# Altium schematic sheet 07 USB.SchDoc
size 420 x 297 mm
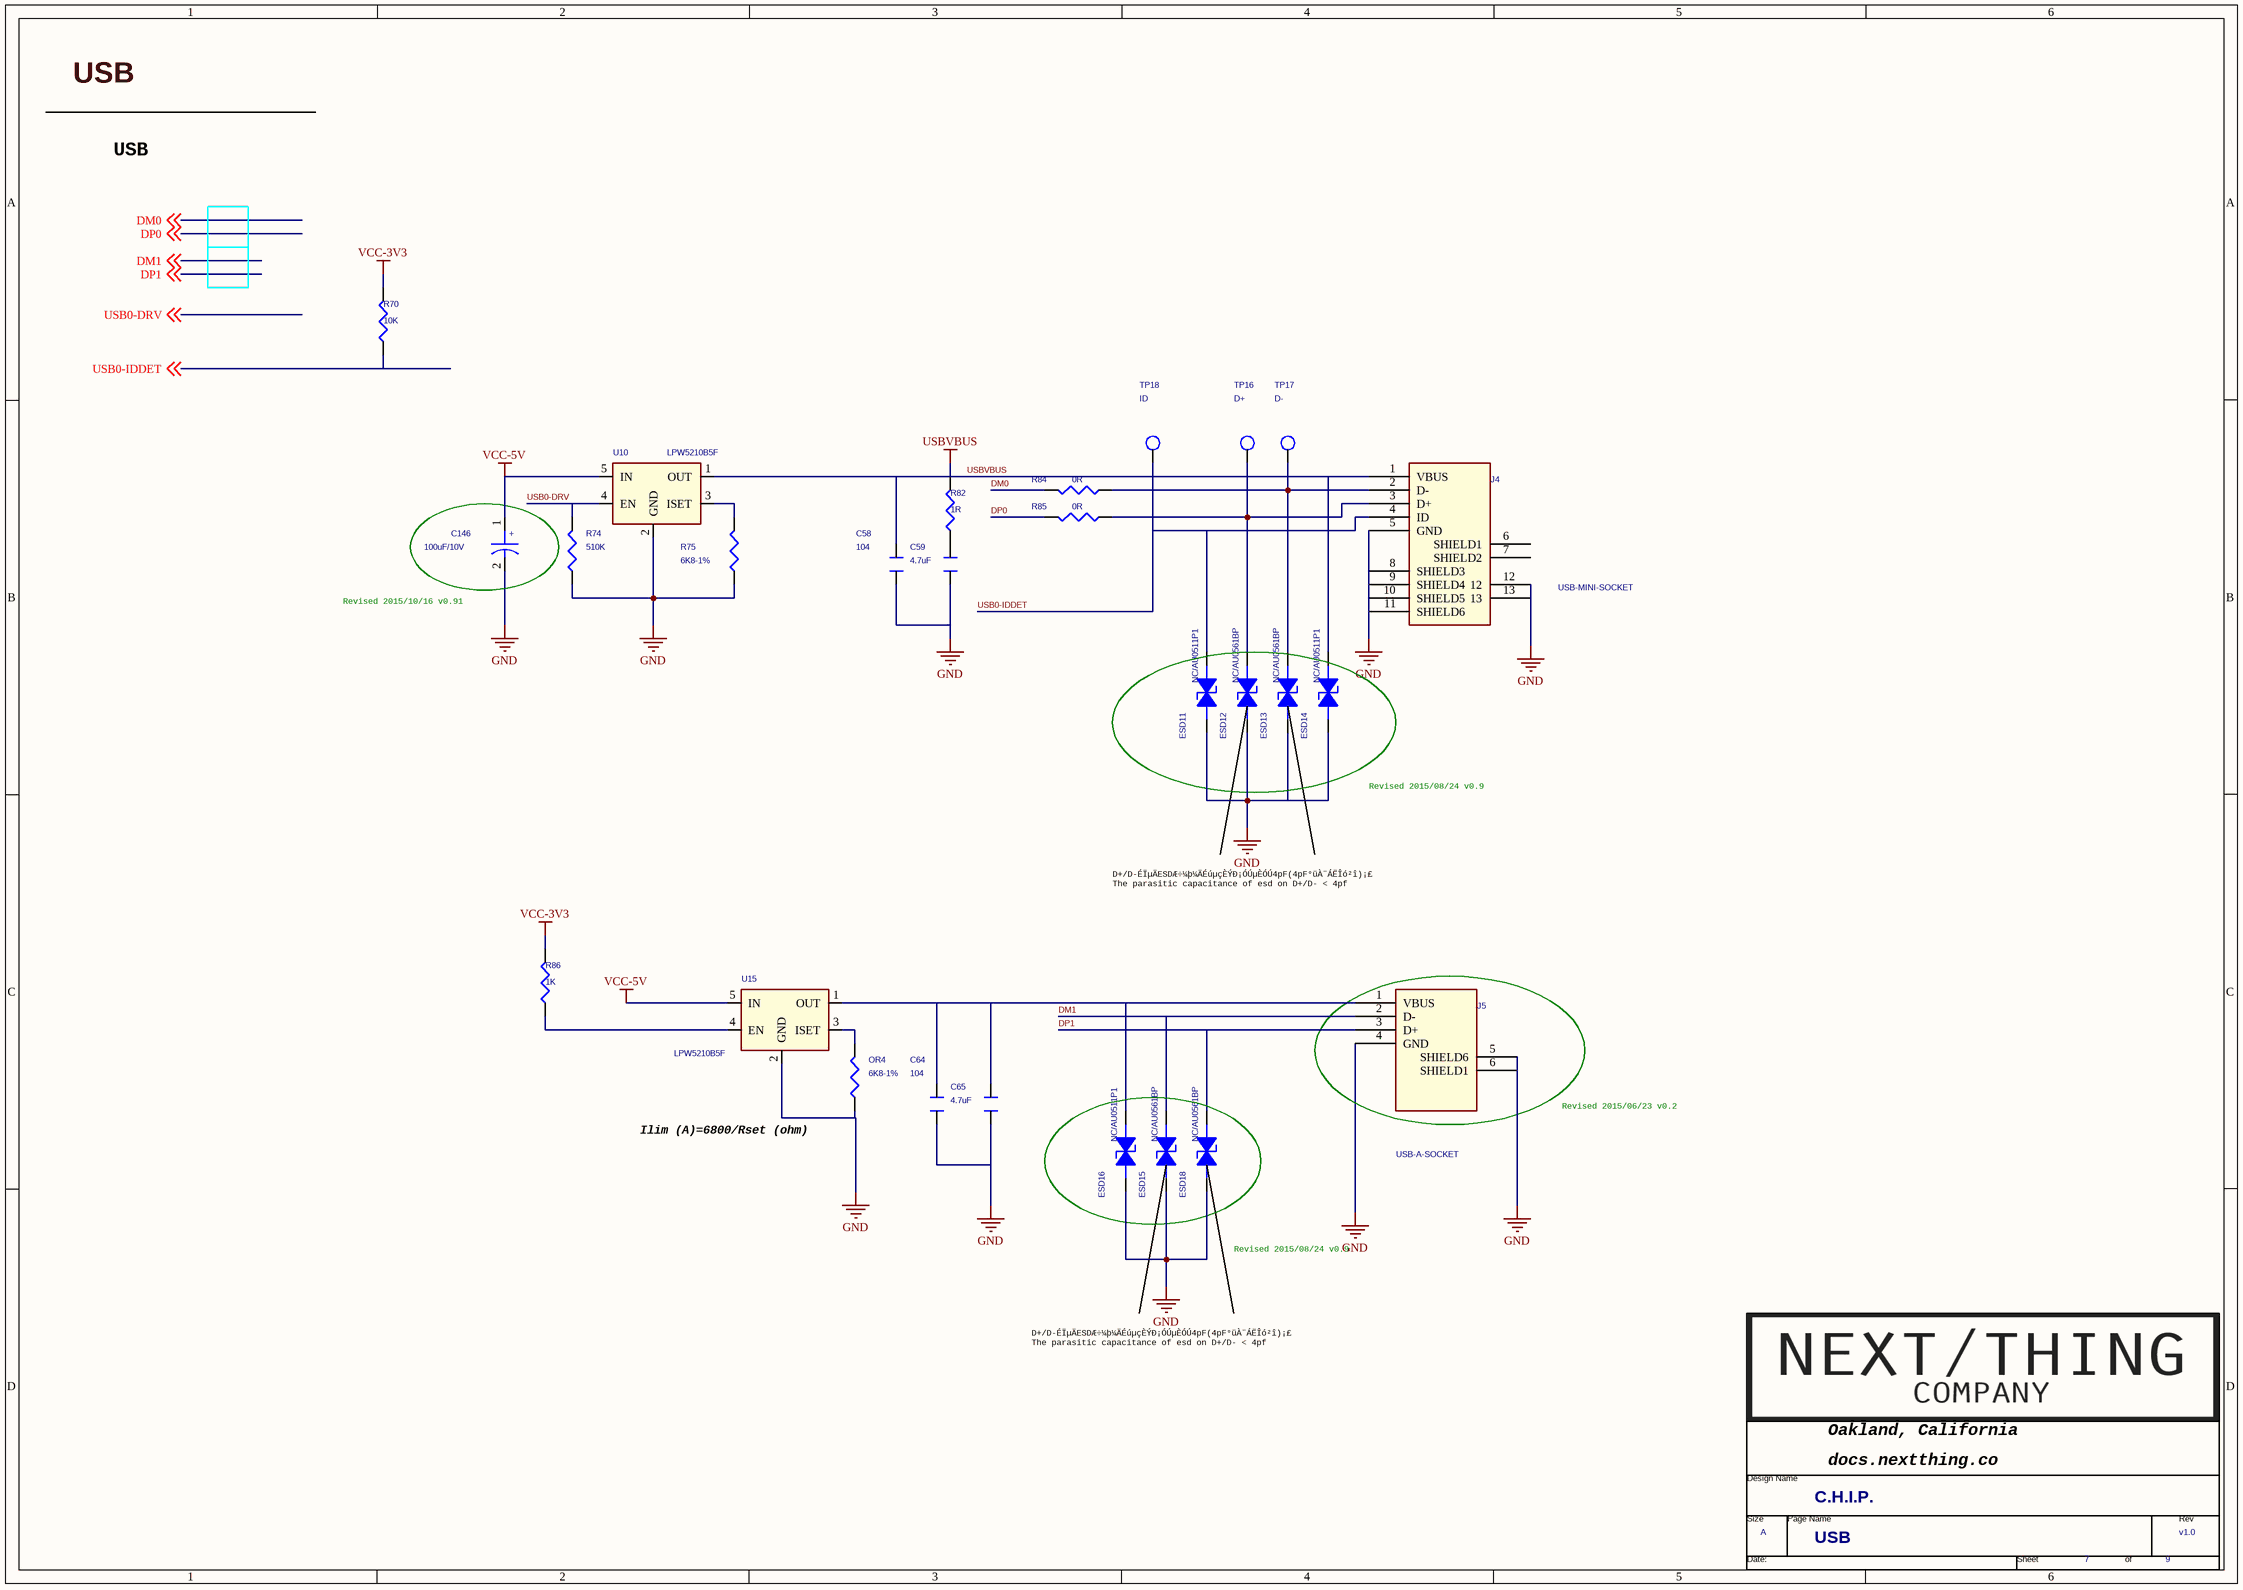
[diagram p0: 07 USB.SchDoc]

## Parts
*  Page Count: 9  Page Number: 7  Page Size: A  Title: C.H.I.P.  RevCode: v1.0  Doc: USB  (hidden comment: TitleBlock1-nextthing)  (graphical)
C58  104  [C0201]
C59  4.7uF  [CC0603]
C64  104  [C0201]
C65  4.7uF  [CC0603]
C146  100uF/10V  [CT1210]
ESD11  NC/AU0511P1  [R0402]
ESD12  NC/AU0561BP  [R0402]
ESD13  NC/AU0561BP  [R0402]
ESD14  NC/AU0511P1  [R0402]
ESD15  NC/AU0561BP  [R0402]
ESD16  NC/AU0511P1  [R0402]
ESD18  NC/AU0561BP  [R0402]
J4  USB-MINI-SOCKET  [USB_MINI_AB]
J5  USB-A-SOCKET  [USB_MINI_AB]
OR4  6K8-1%  [C0201]
R70  10K  [C0201]
R74  510K  [C0201]
R75  6K8-1%  [C0201]
R82  1R  [R0402]
R84  0R  [C0201]
R85  0R  [C0201]
R86  1K  [C0201]
TP16  D+  [tp40_smd]
TP17  D-  [tp40_smd]
TP18  ID  [tp40_smd]
U10  LPW5210B5F  [SOT23-6]
U15  LPW5210B5F  [SOT23-6]

## Nets
GND: C58.1 C59.1 C64.1 C65.1 C146.2 ESD11.2(CATHODE) ESD12.2(CATHODE) ESD13.2(CATHODE) ESD14.2(CATHODE) ESD15.2(CATHODE) ESD16.2(CATHODE) ESD18.2(CATHODE) J4.5(GND) J4.8(SHIELD3) J4.9(SHIELD4) J4.10(SHIELD5) J4.11(SHIELD6) J4.12 J4.13 J5.4(GND) J5.5(SHIELD6) J5.6(SHIELD1) OR4.1 R74.1 R75.1 U10.2(GND) U15.2(GND)
USBVBUS: C58.2 ESD14.1(ANODE) J4.1(VBUS) R82.2 U10.1(OUT)
VCC-3V3: R70.2 R86.2
VCC-5V: C146.1 U10.5(IN) U15.5(IN)
DM0: R84.2 ; off-sheet DM0
DM1: ESD15.1(ANODE) J5.2(D-) ; off-sheet DM1
DP0: R85.2 ; off-sheet DP0
DP1: ESD18.1(ANODE) J5.3(D+) ; off-sheet DP1
USB0-DRV: R74.2 U10.4(EN) ; off-sheet USB0-DRV
USB0-IDDET: ESD11.1(ANODE) J4.4(ID) R70.1 TP18.1(TP) ; off-sheet USB0-IDDET
NetC59_2: C59.2 R82.1
NetC64_2: C64.2 C65.2 ESD16.1(ANODE) J5.1(VBUS) U15.1(OUT)
NetESD12_1: ESD12.1(ANODE) J4.3(D+) R85.1 TP16.1(TP)
NetESD13_1: ESD13.1(ANODE) J4.2(D-) R84.1 TP17.1(TP)
NetOR4_2: OR4.2 U15.3(ISET)
NetR75_2: R75.2 U10.3(ISET)
NetR86_1: R86.1 U15.4(EN)

Not connected (* = marked no-connect by the designer): J4 6(SHIELD1) 7(SHIELD2)

## Notes on the sheet
- USB
- Revised 2015/10/16 v0.91
- Revised 2015/08/24 v0.9
- D+/D-ÉÏµÄESDÆ÷¼þ¼ÄÉúµçÈÝÐ¡ÓÚµÈÓÚ4pF(4pF°üÀ¨ÁËÎó²î)¡£
  The parasitic capacitance of esd on D+/D- < 4pf
- Ilim (A)=6800/Rset (ohm)
- Revised 2015/06/23 v0.2
- (in symbol CAPACITOR_POL) +
- (in symbol TitleBlock1-nextthing) Oakland, California; Design Name; docs.nextthing.co /; Size; Page Name; Rev; Date:; Sheet; of

## Library data of the parts
C58 C59 C64 C65 = CAPACITOR
C146 = CAPACITOR_POL: ROOM: MODEM
ESD11-ESD16 ESD18 = 1_1.5KE100A: 1ST PART DESCRIPTION: WILL ESD9B5V Bidirection ESD Protection
J4 = USB_MINI_SOCKET_2
J5 = USB_MINI_SOCKET_5
OR4 R70 R74 R75 R82 R86 = R_Dup2
R84 R85 = RESISTOR_Dup1
TP16-TP18 = T_POINT_R
U10 U15 = RT9266PE_2
* = TitleBlock1-nextthing: Page Create Date: March  8, 1995